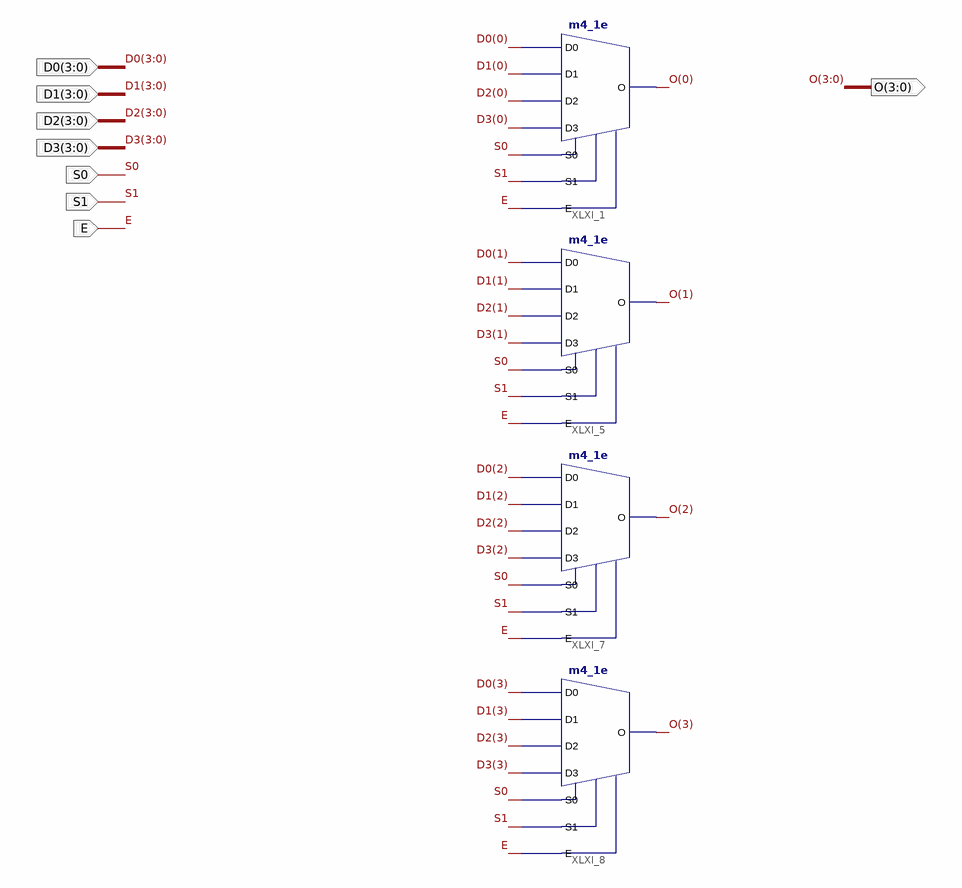
[diagram p0: schematic sheet 1]
// Xilinx ISE schematic mux4_2.sch (spartan3e) as structural Verilog: 4 symbols, 8 ports
module mux4_2 (
  input  S1,
  input  S0,
  input  E,
  input  [3:0] D0,
  input  [3:0] D1,
  input  [3:0] D2,
  input  [3:0] D3,
  output [3:0] O
);

  m4_1e XLXI_1 (.D0(D0[0]), .D1(D1[0]), .D2(D2[0]), .D3(D3[0]), .E(E), .S0(S0), .S1(S1), .O(O[0]));
  m4_1e XLXI_5 (.D0(D0[1]), .D1(D1[1]), .D2(D2[1]), .D3(D3[1]), .E(E), .S0(S0), .S1(S1), .O(O[1]));
  m4_1e XLXI_7 (.D0(D0[2]), .D1(D1[2]), .D2(D2[2]), .D3(D3[2]), .E(E), .S0(S0), .S1(S1), .O(O[2]));
  m4_1e XLXI_8 (.D0(D0[3]), .D1(D1[3]), .D2(D2[3]), .D3(D3[3]), .E(E), .S0(S0), .S1(S1), .O(O[3]));
endmodule
